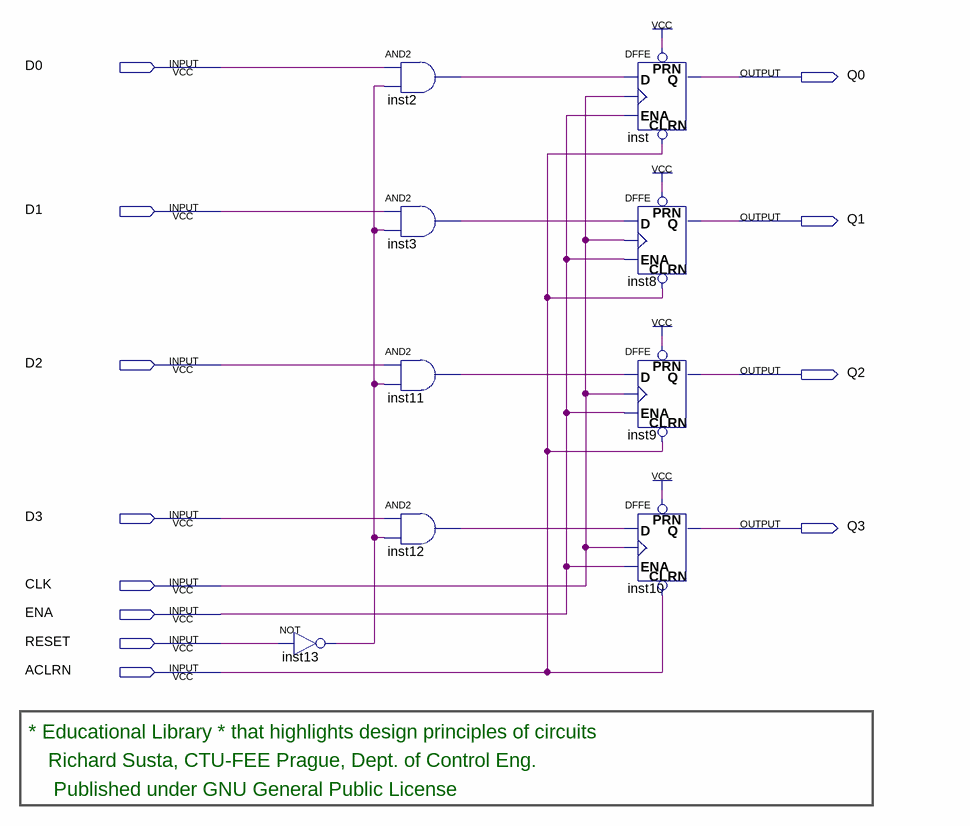
[diagram p0: schematic sheet]
// Quartus schematic register4bits.bdf as structural Verilog: 9 symbols, 12 pins
module register4bits (
  input  D0,
  input  D1,
  input  D2,
  input  D3,
  input  CLK,
  input  ENA,
  input  RESET,
  input  ACLRN,
  output Q0,
  output Q1,
  output Q2,
  output Q3
);

  wire inst2_out, inst3_out, inst11_out, inst12_out, inst13_out;

  not inst13 (inst13_out, RESET);
  and inst2 (inst2_out, D0, inst13_out);
  and inst3 (inst3_out, D1, inst13_out);
  and inst11 (inst11_out, D2, inst13_out);
  and inst12 (inst12_out, D3, inst13_out);
  DFFE inst (.PRN(1'b1), .CLRN(ACLRN), .D(inst2_out), .CLK(CLK), .ENA(ENA), .Q(Q0));
  DFFE inst8 (.PRN(1'b1), .CLRN(ACLRN), .D(inst3_out), .CLK(CLK), .ENA(ENA), .Q(Q1));
  DFFE inst9 (.PRN(1'b1), .CLRN(ACLRN), .D(inst11_out), .CLK(CLK), .ENA(ENA), .Q(Q2));
  DFFE inst10 (.PRN(1'b1), .CLRN(ACLRN), .D(inst12_out), .CLK(CLK), .ENA(ENA), .Q(Q3));

  // Notes on the sheet:
  //   * Educational Library * that highlights design principles of circuits
  //   Richard Susta, CTU-FEE Prague, Dept. of Control Eng. 
  //    Published under GNU General Public License
endmodule
